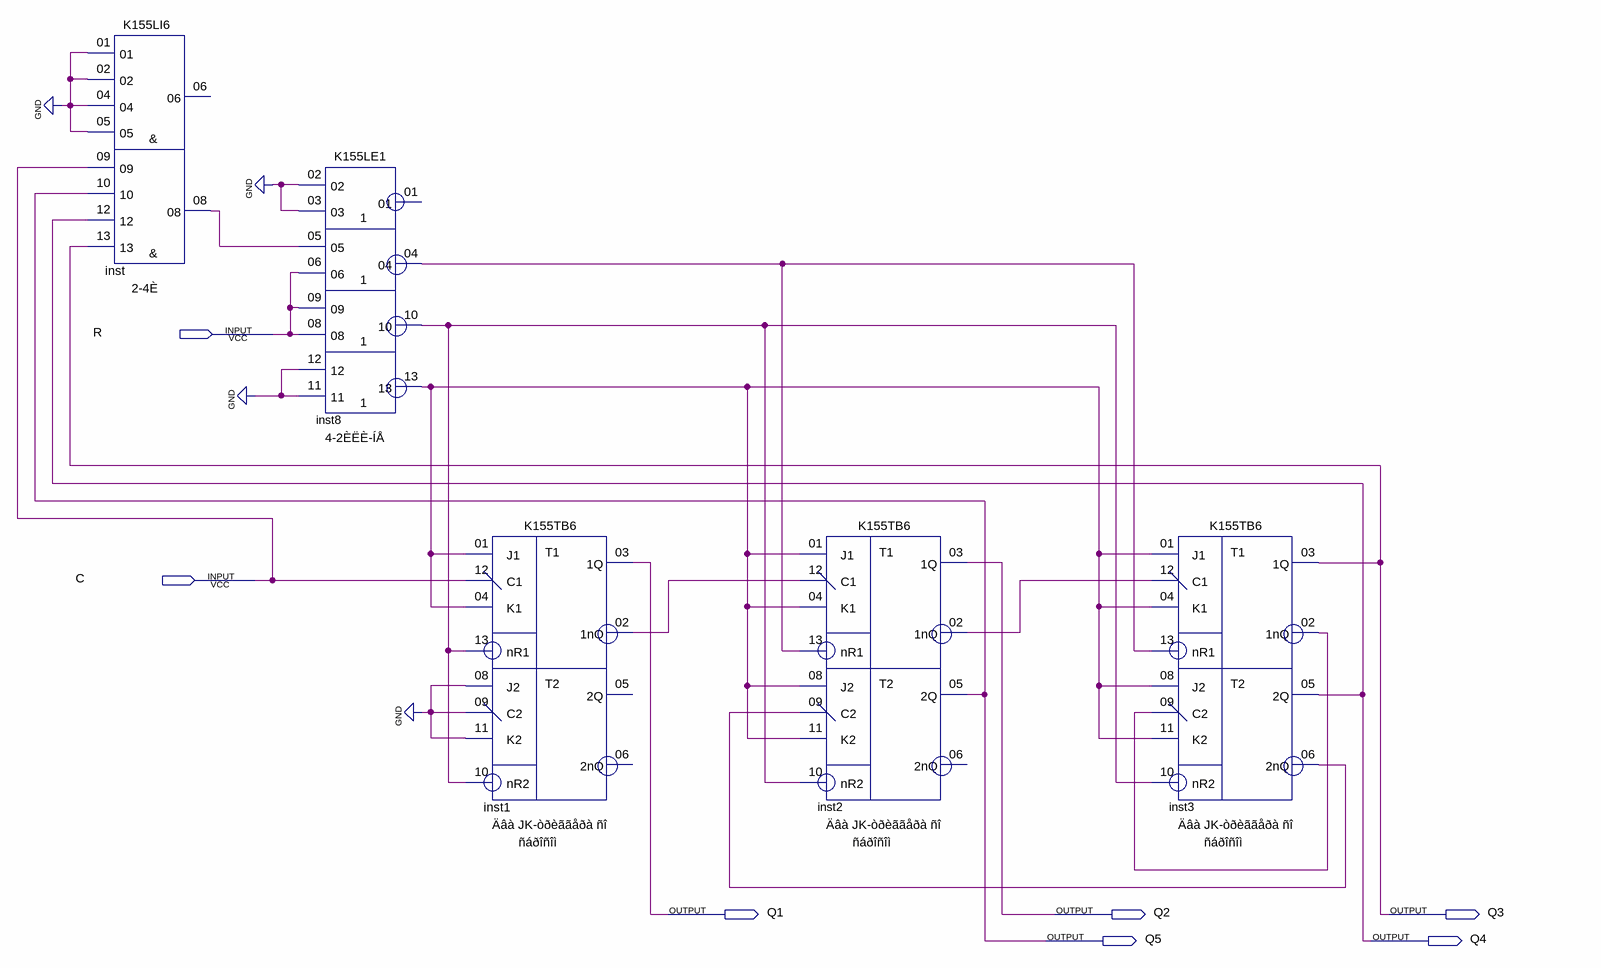
[diagram p0: schematic sheet]
// Quartus schematic scheme.bdf as structural Verilog: 5 symbols, 7 pins
module scheme (
  input  R,
  input  C,
  output Q1,
  output Q2,
  output Q3,
  output Q5,
  output Q4
);

  wire inst1_1nq, inst2_1nq, inst3_1nq, inst3_2nq, inst8_04, inst8_10, inst8_13, inst_08;

  K155LI6 inst (
    .\01 (1'b0), .\02 (1'b0), .\04 (1'b0), .\05 (1'b0), .\09 (C), .\10 (Q5), .\12 (Q4), .\13 (Q3),
    .\08 (inst_08));  // open: 06
  K155LE1 inst8 (
    .\02 (1'b0), .\03 (1'b0), .\05 (inst_08), .\06 (R), .\09 (R), .\08 (R), .\12 (1'b0), .\11 (1'b0),
    .\04 (inst8_04), .\10 (inst8_10), .\13 (inst8_13));  // open: 01
  K155TB6 inst1 (
    .J1(inst8_13), .nR1(inst8_10), .C1(C), .K1(inst8_13), .J2(1'b0), .nR2(inst8_10), .C2(1'b0), .K2(1'b0),
    .\1Q (Q1), .\1nQ (inst1_1nq));  // open: 2Q, 2nQ
  K155TB6 inst2 (
    .J1(inst8_13), .nR1(inst8_04), .C1(inst1_1nq), .K1(inst8_13), .J2(inst8_13), .nR2(inst8_10),
    .C2(inst3_2nq), .K2(inst8_13), .\1Q (Q2), .\1nQ (inst2_1nq), .\2Q (Q5));  // open: 2nQ
  K155TB6 inst3 (
    .J1(inst8_13), .nR1(inst8_04), .C1(inst2_1nq), .K1(inst8_13), .J2(inst8_13), .nR2(inst8_10),
    .C2(inst3_1nq), .K2(inst8_13), .\1Q (Q3), .\1nQ (inst3_1nq), .\2Q (Q4), .\2nQ (inst3_2nq));
endmodule
